# EasyEDA Pro project PID调试器（第二版）.eprj, board PCB1
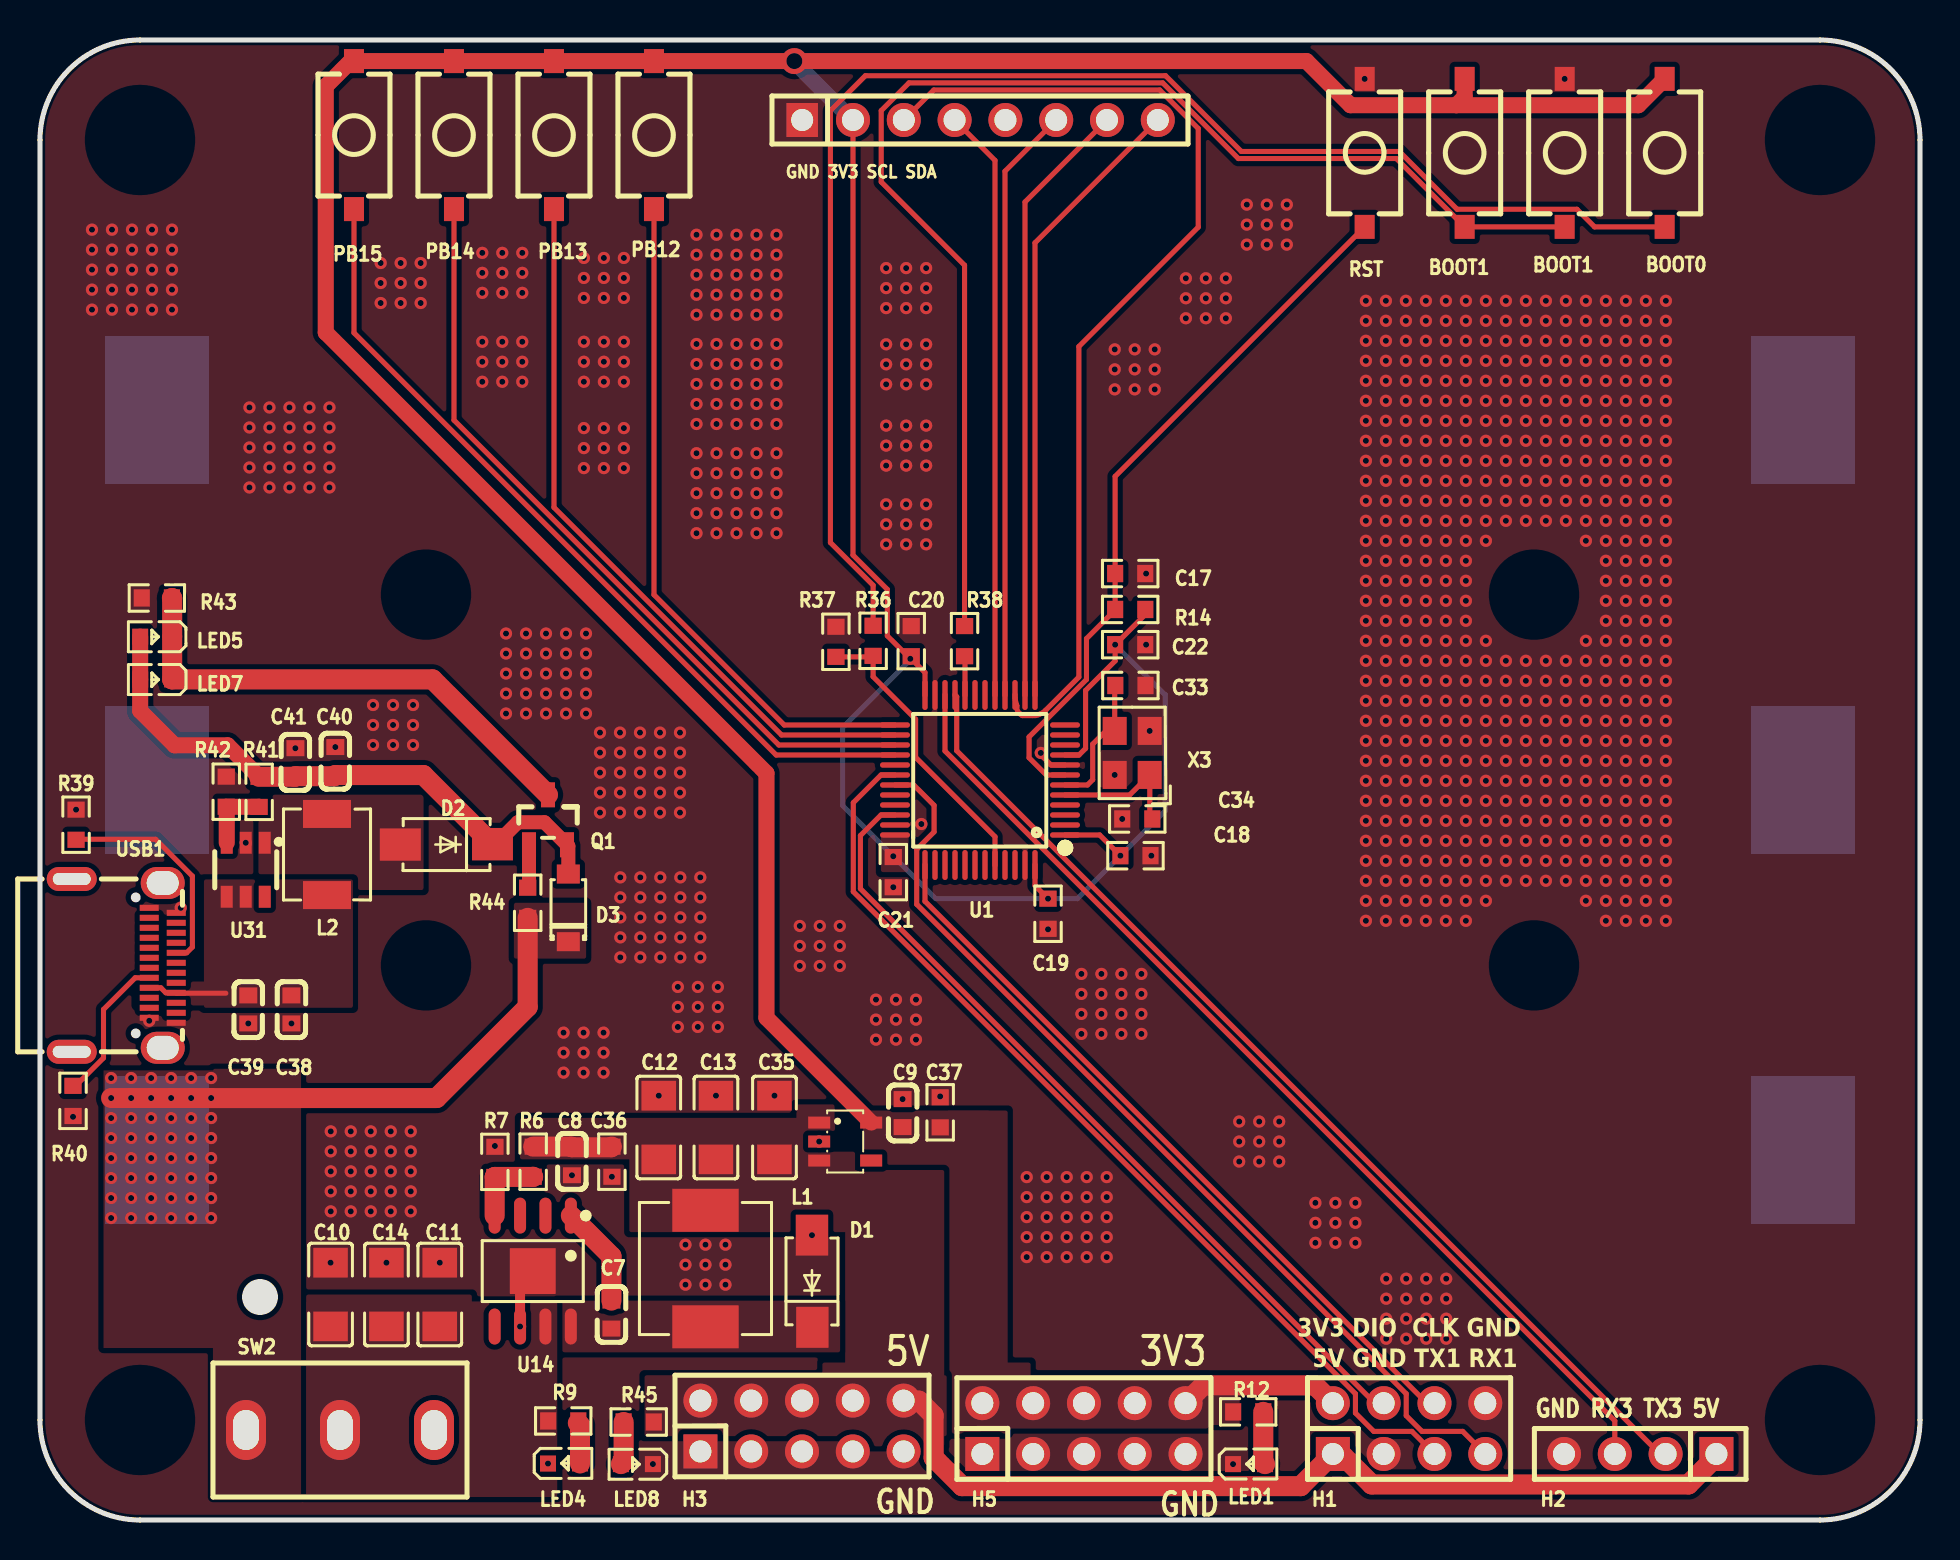
[diagram p1: board, top side]
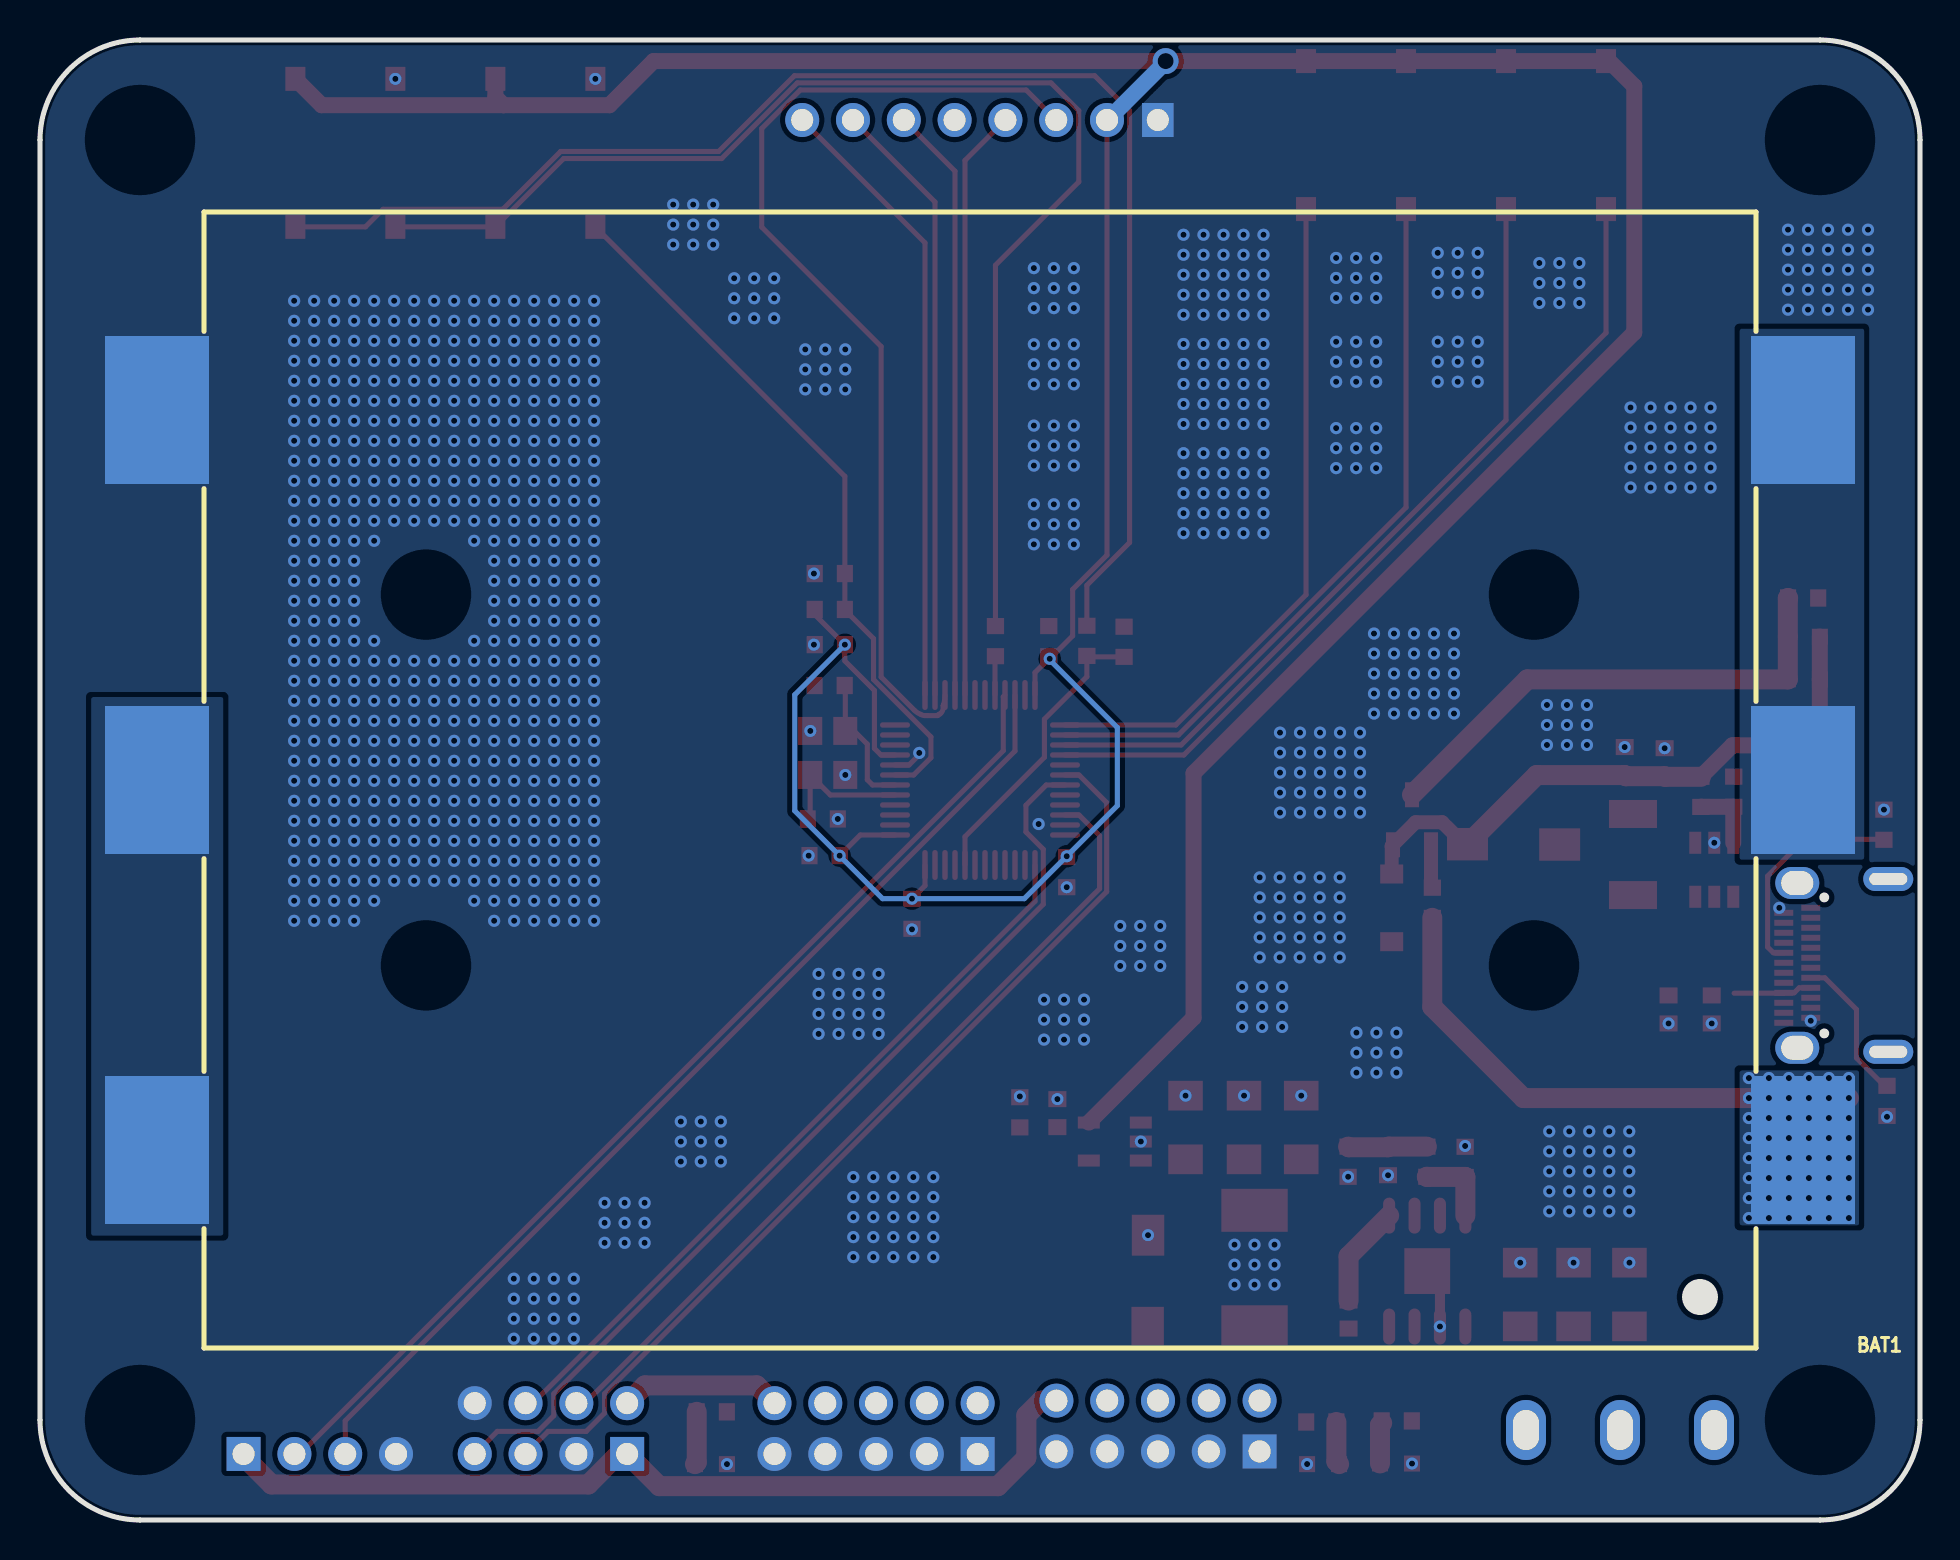
[diagram p2: board, bottom side, seen from below]

Outline 94 x 74 mm; copper layers: Top Layer, Bottom Layer. Coordinates in mm from the lower left corner of the outline.
Outline path: 0,69 0,5 arc(1.46,1.46) 5,0 89,0 arc(92.54,1.46) 94,5 94,69 arc(92.54,72.54) 89,74 5,74 arc(1.46,72.54) 0,69
Stack: Top Layer 0.035mm / Dielectric1 1.51mm FR4 er 4.5 / Bottom Layer 0.035mm

## Design rules (mm)
net OSC_OUT: DP1
net OSC_IN: DP1
template: 自定义配置
spacing copperThickness1oz (default): track to track 0.102, other pairs 0.152 to 0.3
spacing copperThickness2oz: track to track 0.203, other pairs 0.152 to 0.3
track width copperThickness1oz (default): min 0.127, default 0.254, max 2.54
track width copperThickness2oz: min 0.203, default 0.254, max 2.54
differential pair differentialPair (default): width min 0.127, default 0.254, max 2.54; gap min 0.152, default 0.152
via viaSize (default): diameter min 0.5, default 0.61, max 10; hole min 0.3, default 0.305, max 6.3

## Placement (name value [footprint] x y rotation side)
BAT1  BH-18650-B5BA016  [BAT-SMD_BH-18650-B5BA016]  47 37 0 bottom
BOOT0  TS-1101-B-W  [KEY-SMD_2P-L6.0-W3.6-P7.4-LS8.0-L]  81.23 68.36 90 top
BOOT1  -  [KEY-SMD_2P-L6.0-W3.6-P7.4-LS8.0-L]  71.23 68.36 90 top
BOOT1#2  -  [KEY-SMD_2P-L6.0-W3.6-P7.4-LS8.0-L]  76.23 68.36 270 top
C7  100nF  [C0603]  28.57 10.27 270 top
C8  100nF  [C0603]  26.6 17.94 90 top
C9  100nF  [C0603]  43.13 20.34 270 top
C10  100uF  [C1206]  14.53 11.27 270 top
C11  100uF  [C1206]  19.99 11.27 270 top
C12  100uF  [C1206]  30.94 19.62 270 top
C13  100uF  [C1206]  33.8 19.62 270 top
C14  100uF  [C1206]  17.32 11.27 270 top
C17  100nF  [R0603]  54.51 47.32 180 top
C18  100nF  [R0603]  54.77 33.22 180 top
C19  100nF  [R0603]  50.4 30.31 90 top
C20  100nF  [R0603]  43.56 43.94 270 top
C21  100nF  [R0603]  42.66 32.39 90 top
C22  100nF  [R0603]  54.51 43.77 180 top
C33  12pF  [R0603]  54.52 41.72 180 top
C34  12pF  [R0603]  54.86 35.05 180 top
C35  100uF  [C1206]  36.72 19.62 270 top
C36  100nF  [R0603]  28.59 17.92 90 top
C37  100nF  [R0603]  45.01 20.38 270 top
C38  22uF  [C0603]  12.57 25.53 90 top
C39  22uF  [C0603]  10.41 25.53 90 top
C40  22uF  [C0603]  14.77 37.95 90 top
C41  22uF  [C0603]  12.77 37.89 90 top
D1  SS54  [SMA_L4.3-W2.6-LS5.0-FD]  38.61 11.94 270 top
D2  SS34  [SMA_L4.3-W2.6-LS5.0-FD]  20.32 33.78 0 top
D3  1N4148W-E3-08  [SOD-123_L2.8-W1.8-LS3.7-RD]  26.42 30.61 90 top
GND 3V3 SCL SDA  PM254-1-08-Z-8.5  [HDR-TH_8P-P2.54-V-F]  47 70 0 top
H1  HX PZ2.54-4x2P ZZ  [HDR-TH_8P-P2.54-V-M-R2-C4-S2.54]  68.45 4.57 0 top
H2  2.54-1*4P母  [HDR-TH_4P-P2.54-V-F]  80.01 3.3 180 top
H3  PZ254V-12-10P  [HDR-TH_10P-P2.54-V-M-R2-C5-S2.54]  38.1 4.7 0 top
H5  PZ254V-12-10P  [HDR-TH_10P-P2.54-V-M-R2-C5-S2.54]  52.2 4.57 0 top
L1  22uH  [IND-SMD_L7.1-W6.6]  33.27 12.57 90 top
L2  3.3uH  [IND-SMD_L4.4-W4.2-A]  14.35 33.27 270 top
LED1  LTST-C190KSKT  [LED0603-RD]  60.45 2.79 0 top
LED4  -  [LED_0603]  26.25 2.83 0 top
LED5  -  [LED_0603]  5.76 44.16 180 top
LED7  -  [LED_0603]  5.76 42.02 180 top
LED8  LTST-C190KSKT  [LED0603-RD]  29.84 2.79 180 top
PB12  TS-1101-B-W  [KEY-SMD_2P-L6.0-W3.6-P7.4-LS8.0-L]  30.7 69.25 90 top
PB13  TS-1101-B-W  [KEY-SMD_2P-L6.0-W3.6-P7.4-LS8.0-L]  25.7 69.25 90 top
PB14  TS-1101-B-W  [KEY-SMD_2P-L6.0-W3.6-P7.4-LS8.0-L]  20.7 69.25 90 top
PB15  TS-1101-B-W  [KEY-SMD_2P-L6.0-W3.6-P7.4-LS8.0-L]  15.7 69.25 90 top
Q1  -  [S8550P_SOT]  25.4 35.05 270 top
R6  10K  [R0603]  24.66 17.92 90 top
R7  10K  [R0603]  22.74 17.91 270 top
R9  1K  [R0603]  26.16 4.95 180 top
R12  1kΩ  [R0603]  60.41 5.41 180 top
R14  10kΩ  [R0603]  54.51 45.53 0 top
R36  360  [R0603]  41.66 43.96 90 top
R37  1.5K  [R0603]  39.8 43.91 270 top
R38  1.5K  [R0603]  46.23 43.94 270 top
R39  5.1K  [R0603]  1.8 34.76 270 top
R40  5.1K  [R0603]  1.65 20.95 270 top
R41  190K  [R0603]  10.96 36.41 270 top
R42  10K  [R0603]  9.31 36.42 90 top
R43  500R  [R0603]  5.84 46.1 0 top
R44  1K  [R0603]  24.38 30.86 90 top
R45  1kΩ  [R0603]  29.93 4.9 0 top
RST  TS-1101-B-W  [KEY-SMD_2P-L6.0-W3.6-P7.4-LS8.0-L]  66.23 68.36 270 top
SW2  SS-12D10L5  [SW-TH_SS-12D10L5]  15 4.5 180 top
U1  STM32F103C8T6  [LQFP-48_L7.0-W7.0-P0.50-LS9.0-BL]  47 37 90 top
U14  TPS5450DDAR  [SOP-8_L4.9-W3.9-P1.27-LS6.0-BL-EP]  24.64 12.45 180 top
U15  TLV75533PDBVR  [SOT-23-5_L3.0-W1.7-P0.95-LS2.8-BR]  40.26 18.92 180 top
U31  HFP6291LR-G1  [SOT-23-6_L2.9-W1.6-P0.95-LS2.8-BR]  10.29 32.51 90 top
USB1  TYPEC-324G-BCP24  [USB-C-SMD_TYPEC-324G-BCP24]  4.2 27.73 270 top
X3  8MHz  [CRYSTAL-SMD_4P-L3.2-W2.5-BL-1]  54.61 38.35 90 top

## Footprints (pads in the part's own frame, mm; a bottom-side part is the same pattern mirrored in y, then rotated)
BAT-SMD_BH-18650-B5BA016
  rect 5.2x7.4 smd: 1(-41.15,18.5) 2(41.15,18.5) 3(-41.15,0) 4(41.15,0) 5(-41.15,-18.5) 6(41.15,-18.5)
C0603
  rect 0.8x0.9 smd: 1(-0.7,0) 2(0.7,0)
C1206
  rect 1.485x1.728 smd: 1(-1.593,0) 2(1.593,0)
CRYSTAL-SMD_4P-L3.2-W2.5-BL-1
  rect 1.4x1.2 smd: 1(-1.1,-0.875) 2(1.1,-0.875) 3(1.1,0.875) 4(-1.1,0.875)
HDR-TH_4P-P2.54-V-F
  rect 1.7x1.7 hole 1.1: 1(-3.81,0)
  round 1.7 hole 1.1: 2(-1.27,0) 3(1.27,0) 4(3.81,0)
HDR-TH_8P-P2.54-V-F
  rect 1.575x1.7 hole 1.1: 1(-8.89,0)
  round 1.7 hole 1.1: 2(-6.35,0) 3(-3.81,0) 4(-1.27,0) 5(1.27,0) 6(3.81,0) 7(6.35,0) 8(8.89,0)
HDR-TH_8P-P2.54-V-M-R2-C4-S2.54
  rect 1.7x1.7 hole 1.1: 1(-3.81,-1.27)
  round 1.7 hole 1.1: 2(-3.81,1.27) 3(-1.27,-1.27) 4(-1.27,1.27) 5(1.27,-1.27) 6(1.27,1.27) 7(3.81,-1.27) 8(3.81,1.27)
HDR-TH_10P-P2.54-V-M-R2-C5-S2.54
  rect 1.7x1.7 hole 1.1: 1(-5.08,-1.27)
  round 1.7 hole 1.1: 2(-5.08,1.27) 3(-2.54,-1.27) 4(-2.54,1.27) 5(0,-1.27) 6(0,1.27) 7(2.54,-1.27) 8(2.54,1.27) 9(5.08,-1.27) 10(5.08,1.27)
IND-SMD_L4.4-W4.2-A
  rect 1.4x2.4 smd: 1(2.028,0) 2(-2.028,0)
IND-SMD_L7.1-W6.6
  rect 2.15x3.32 smd: 1(-2.913,0) 2(2.913,0)
KEY-SMD_2P-L6.0-W3.6-P7.4-LS8.0-L
  rect 1.2x1 smd: 1(-3.7,0) 2(3.7,0)
LED0603-RD
  rect 0.8x0.8 smd: 1(-0.799,0) 2(0.799,0)
LED_0603
  rect 0.8x0.8 smd: 1(-0.851,-0.01) 2(0.75,-0.005)
LQFP-48_L7.0-W7.0-P0.50-LS9.0-BL
  oval 0.27x1.5 smd: 1(-2.75,-4.25) 2(-2.25,-4.25) 3(-1.75,-4.25) 4(-1.25,-4.25) 5(-0.75,-4.25) 6(-0.25,-4.25) 7(0.25,-4.25) 8(0.75,-4.25) 9(1.25,-4.25) 10(1.75,-4.25) 11(2.25,-4.25) 12(2.75,-4.25) 25(2.75,4.25) 26(2.25,4.25) 27(1.75,4.25) 28(1.25,4.25) 29(0.75,4.25) 30(0.25,4.25) 31(-0.25,4.25) 32(-0.75,4.25) 33(-1.25,4.25) 34(-1.75,4.25) 35(-2.25,4.25) 36(-2.75,4.25)
  oval 1.5x0.27 smd: 13(4.25,-2.75) 14(4.25,-2.25) 15(4.25,-1.75) 16(4.25,-1.25) 17(4.25,-0.75) 18(4.25,-0.25) 19(4.25,0.25) 20(4.25,0.75) 21(4.25,1.25) 22(4.25,1.75) 23(4.25,2.25) 24(4.25,2.75) 37(-4.25,2.75) 38(-4.25,2.25) 39(-4.25,1.75) 40(-4.25,1.25) 41(-4.25,0.75) 42(-4.25,0.25) 43(-4.25,-0.25) 44(-4.25,-0.75) 45(-4.25,-1.25) 46(-4.25,-1.75) 47(-4.25,-2.25) 48(-4.25,-2.75)
R0603
  rect 0.806x0.864 smd: 1(-0.753,0) 2(0.753,0)
S8550P_SOT
  rect 1.25x0.701 smd: 1(1.292,-0.95) 2(1.292,0.95) 3(-1.208,0)
SMA_L4.3-W2.6-LS5.0-FD
  rect 2.046x1.62 smd: 1(-2.304,-0.009) 2(2.304,0.009)
SOD-123_L2.8-W1.8-LS3.7-RD
  rect 0.95x1.15 smd: 1(-1.692,0) 2(1.692,0)
SOP-8_L4.9-W3.9-P1.27-LS6.0-BL-EP
  oval 0.6x1.8 smd: 1(-1.905,-2.772) 2(-0.635,-2.772) 3(0.635,-2.772) 4(1.905,-2.772) 5(1.905,2.772) 6(0.635,2.772) 7(-0.635,2.772) 8(-1.905,2.772)
  rect 2.29x2.29 smd: 9(0,0)
SOT-23-5_L3.0-W1.7-P0.95-LS2.8-BR
  rect 1.1x0.6 smd: 1(1.3,-0.95) 2(1.3,0) 3(1.3,0.95) 4(-1.3,0.95) 5(-1.3,-0.95)
SOT-23-6_L2.9-W1.6-P0.95-LS2.8-BR
  rect 1.1x0.6 smd: 1(1.35,-0.95) 2(1.35,0) 3(1.35,0.95) 4(-1.35,0.95) 5(-1.35,0) 6(-1.35,-0.95)
SW-TH_SS-12D10L5
  oval 2x3 hole 1.3x2: 1(-4.7,0) 2(0,0) 3(4.7,0)
USB-C-SMD_TYPEC-324G-BCP24
  oval 1.6x2.2 hole 1.2x1.6: 1(-4.12,1.938) 2(4.12,1.938)
  oval 1.2x2.5 hole 0.6x1.9: 3(-4.32,-2.612) 4(4.32,-2.612)
  rect 0.3x0.95 smd: A1(-2.63,2.612) A2(-2.13,2.612) A3(-1.63,2.612) A4(-1.13,2.612) A5(-0.63,2.612) A6(-0.13,2.612) A7(0.37,2.612) A8(0.87,2.612) A9(1.37,2.612) A10(1.87,2.612) A11(2.37,2.612) A12(2.87,2.612) B1(2.62,1.262) B2(2.12,1.262) B3(1.62,1.262) B4(1.12,1.262) B5(0.62,1.262) B6(0.12,1.262) B7(-0.38,1.262) B8(-0.88,1.262) B9(-1.38,1.262) B10(-1.88,1.262) B11(-2.38,1.262) B12(-2.88,1.262)

## Nets
3V3: BOOT0.2 BOOT1.2 C9.2 C18.2 C19.2 C20.2 C21.2 C22.2 C37.2 GND 3V3 SCL SDA.2 H1.2 H5.2 H5.4 H5.6 H5.8 H5.10 PB12.2 PB13.2 PB14.2 PB15.2 R12.2 R14.2 U1.1 U1.9 U1.24 U1.36 U1.48 U15.5
+5V: C8.2 C12.2 C13.2 C35.2 C36.2 H1.1 H2.1 H3.2 H3.4 H3.6 H3.8 H3.10 L1.2 R6.2 R45.2 U15.1 U15.3
+12V: C40.1 C41.1 D2.2 D3.2 LED5.2 LED7.2 Q1.2 R41.1
GND: BAT1.6 BOOT1#2.1 C8.1 C9.1 C10.1 C11.1 C12.1 C13.1 C14.1 C17.1 C18.1 C19.1 C20.1 C21.1 C22.1 C33.1 C34.2 C35.1 C36.1 C37.1 C38.1 C39.1 C40.2 C41.2 D1.1 GND 3V3 SCL SDA.1 H1.3 H1.8 H2.4 H3.1 H3.3 H3.5 H3.7 H3.9 H5.1 H5.3 H5.5 H5.7 H5.9 LED1.1 LED4.1 LED8.1 R7.1 R37.1 R39.1 R40.2 R42.2 R43.1 RST.1 U1.8 U1.23 U1.35 U1.47 U14.6 U14.9 U15.2 U31.2 USB1.A1 USB1.A12 USB1.B1 USB1.B12 X3.2 X3.4
VCC: C38.2 C39.2 L2.1 U31.4 U31.5 USB1.A9 USB1.B4
VIN: BAT1.1 D3.1 R44.1 SW2.3
BOOT0: R36.1 R37.2 U1.44
BOOT1: R38.2 U1.20
NRST: C17.2 R14.1 RST.2 U1.7
OSC32_IN: U1.3
OSC32_OUT: U1.4
OSC_IN: C34.1 U1.5 X3.1
OSC_OUT: C33.2 U1.6 X3.3
PA0: U1.10
PA1: U1.11
PA2: U1.12
PA3_BL: GND 3V3 SCL SDA.8 U1.13
PA6_DC: GND 3V3 SCL SDA.6 U1.16
PA8: U1.29
PA13/SWDIO: H1.4 U1.34
PA14/SWCLK: H1.6 U1.37
PA15: U1.38
PB0_DC: U1.18
PB1_BL: U1.19
PB3: U1.39
PB4: U1.40
PB5: U1.41
PB6: U1.42
PB7: U1.43
PB8: U1.45
PB9: U1.46
PB12_01: PB12.1 U1.25
PB13_02: PB13.1 U1.26
PB14_03: PB14.1 U1.27
PB15_04: PB15.1 U1.28
PC13: U1.2
SPI_CS_NSS: GND 3V3 SCL SDA.7 U1.14
SPI_SCL_SCK: GND 3V3 SCL SDA.3 U1.15
SPI_SDA_MOSI: GND 3V3 SCL SDA.4 U1.17
USART1_RX: H1.7 U1.31
USART1_TX: H1.5 U1.30
USART3_RX: H2.3 U1.22
USART3_TX: H2.2 U1.21
USB_D+_PA12: U1.33
USB_D-_PA11: U1.32
$1N1992: LED1.2 R12.1
$1N3257: BOOT1.1 BOOT1#2.2 R38.1
$1N4251: C10.2 C11.2 C14.2 R9.2 SW2.2 U14.7
$1N4254: C7.2 D1.2 L1.1 U14.8
$1N4256: C7.1 U14.1
$1N4260: R6.1 R7.2 U14.4
$1N4269: LED4.2 R9.1
$1N6190: BAT1.2 BAT1.4
$1N6207: BAT1.3 BAT1.5
$1N14427: R39.2 USB1.A5
$1N14460: R40.1 USB1.B5
$1N14741: D2.1 L2.2 U31.1
$1N14892: R41.2 R42.1 U31.3
$1N19318: LED5.1 LED7.1 Q1.3 R43.2
$1N19371: Q1.1 R44.2
$1N21612: BOOT0.1 R36.2
$1N31426: LED8.2 R45.1

Pads without a net: GND 3V3 SCL SDA 5; SW2 1; U14 2 3 5; U15 4; U31 6; USB1 1 2 3 4 A2 A3 A4 A6 A7 A8 A10 A11 B2 B3 B6 B7 B8 B9 B10 B11

## Via types
v1: diameter 0.61, hole 0.305, Top Layer to Bottom Layer, 1032 vias
v2: diameter 1.3, hole 0.8, Top Layer to Bottom Layer, 1 via

## Routing (per net, layer and track width the routed paths; a pad name or vN(x,y) marks a point on that pad's centre or on a via; arc(x,y) is an arc through that point)
3V3: length 228.4
  Top Layer w0.254: R14.2 55.26,45.27 v1(53.76,43.77) 53.76,42.95 52.28,41.48 52.28,38.58 51.95,38.25 U1.9 ; U1.48 49.75,31.72 v1(50.4,31.07) ; U1.24 44.25,42.37 43.69,42.93 ; v1(54.02,33.22) 52.99,34.25 U1.1 ; GND 3V3 SCL SDA.2 40.65,48.25 42.37,46.53 42.37,44.21 v1(43.51,43.06)
  Top Layer w0.8: 70.82,70.74 65.53,70.74 63.32,72.95 v2(37.72,72.95) PB12.2 PB13.2 PB14.2 PB15.2 15.64,73.01 15.61,73.01 14.29,71.69 14.29,59.37 36.32,37.34 36.32,25.11 U15.5 ; 70.82,70.74 79.92,70.74 BOOT0.2 ; 70.82,70.74 71.23,71.15 BOOT1.2
  Top Layer w1: 57.28,5.84 58.17,6.73 63.75,6.73 H1.2
  Bottom Layer w0.254: v1(53.76,43.77) 56.26,41.26 56.26,35.46 v1(54.02,33.22) 51.87,31.07 v1(50.4,31.07) 44.79,31.07 v1(42.66,33.19) 40.13,35.72 40.13,39.62 43.51,43.01 v1(43.51,43.06)
  Bottom Layer w0.8: GND 3V3 SCL SDA.2 40.62,70 37.72,72.9 v2(37.72,72.95)
+5V: length 49.5
  Top Layer w1: 43.18,5.97 43.94,5.97 44.68,5.23 44.68,3.12 46.1,1.69 63.03,1.69 H1.1 65.06,3.3 66.58,1.78 82.42,1.78 83.82,3.18 ; C36.2 28.56,18.64 C8.2 26.57,18.67 R6.2
+12V: length 30.3
  Top Layer w0.7: D2.2 22.8,33.79 23.89,34.89 25.22,34.89 Q1.2 26.42,33.69 D3.2
  Top Layer w0.8: R41.1 9.38,38.73 6.73,38.73 5.01,40.46 LED7.2 LED5.2
  Top Layer w1: D2.2 19.17,37.25 C40.1 14.71,37.19 C41.1 12.74,37.16 R41.1
GND: length 3.8
  Top Layer w0.254: v1(50.04,38.35) 50.04,38.26 50.55,37.75 U1.8
  Top Layer w0.5: v1(24,9.67) 24,11.81 24.14,11.95
  vias: v1(1.65,20.16) v1(1.8,35.52) v1(2.6,64.52) v1(2.6,63.52) v1(2.6,62.52) v1(2.6,61.52) v1(2.6,60.52) v1(3.6,64.52) v1(3.6,63.52) v1(3.6,62.52) v1(3.6,61.52) v1(3.6,60.52) v1(4.6,64.52) v1(4.6,63.52) v1(4.6,62.52) v1(4.6,61.52) v1(4.6,60.52) v1(5.46,24.96) v1(5.6,64.52) v1(5.6,63.52) v1(5.6,62.52) v1(5.6,61.52) v1(5.6,60.52) v1(6.6,64.52) v1(6.6,63.52) v1(6.6,62.52) v1(6.6,61.52) v1(6.6,60.52) v1(7.04,30.61) v1(10.29,33.86) v1(10.41,24.83) v1(10.47,55.63) v1(10.47,54.63) v1(10.47,53.63) v1(10.47,52.63) v1(10.47,51.63) v1(11.47,55.63) v1(11.47,54.63) v1(11.47,53.63) v1(11.47,52.63) v1(11.47,51.63) v1(12.47,55.63) v1(12.47,54.63) v1(12.47,53.63) v1(12.47,52.63) v1(12.47,51.63) v1(12.57,24.83) v1(12.77,38.59) v1(13.47,55.63) v1(13.47,54.63) v1(13.47,53.63) v1(13.47,52.63) v1(13.47,51.63) v1(14.47,55.63) v1(14.47,54.63) v1(14.47,53.63) v1(14.47,52.63) v1(14.47,51.63) v1(14.54,19.43) v1(14.54,18.43) v1(14.54,17.43) v1(14.54,16.43) v1(14.54,15.43) v1(14.53,12.87) v1(14.77,38.65) v1(15.54,19.43) v1(15.54,18.43) v1(15.54,17.43) v1(15.54,16.43) v1(15.54,15.43) v1(16.54,19.43) v1(16.54,18.43) v1(16.54,17.43) v1(16.54,16.43) v1(16.54,15.43) v1(16.65,40.75) v1(16.65,39.75) v1(16.65,38.75) v1(17.03,62.85) v1(17.03,61.85) v1(17.03,60.85) v1(17.32,12.87) v1(17.54,19.43) v1(17.54,18.43) v1(17.54,17.43) v1(17.54,16.43) v1(17.54,15.43) v1(17.65,40.75) v1(17.65,39.75) v1(17.65,38.75) v1(18.03,62.85) v1(18.03,61.85) v1(18.03,60.85) v1(18.54,19.43) v1(18.54,18.43) v1(18.54,17.43) v1(18.54,16.43) v1(18.54,15.43) v1(18.65,40.75) v1(18.65,39.75) v1(18.65,38.75) v1(19.03,62.85) v1(19.03,61.85) v1(19.03,60.85) v1(19.99,12.87) v1(22.11,63.36) v1(22.11,62.36) v1(22.11,61.36) v1(22.11,58.91) v1(22.11,57.91) v1(22.11,56.91) v1(22.74,18.7) v1(23.11,63.36) v1(23.11,62.36) v1(23.11,61.36) v1(23.11,58.91) v1(23.11,57.91) v1(23.11,56.91) v1(23.3,44.32) v1(23.3,43.32) v1(23.3,42.32) v1(23.3,41.32) v1(23.3,40.32) v1(24.11,63.36) v1(24.11,62.36) v1(24.11,61.36) v1(24.11,58.91) v1(24.11,57.91) v1(24.11,56.91) v1(24.3,44.32) v1(24.3,43.32) v1(24.3,42.32) v1(24.3,41.32) v1(24.3,40.32) v1(25.3,44.32) v1(25.3,43.32) v1(25.3,42.32) v1(25.3,41.32) v1(25.3,40.32) v1(25.4,2.82) v1(26.18,24.37) v1(26.18,23.37) v1(26.18,22.37) v1(26.3,44.32) v1(26.3,43.32) v1(26.3,42.32) v1(26.3,41.32) v1(26.3,40.32) v1(26.6,17.24) v1(27.19,63.1) v1(27.19,62.1) v1(27.19,61.1) v1(27.19,58.91) v1(27.19,57.91) v1(27.19,56.91) v1(27.19,54.59) v1(27.19,53.59) v1(27.19,52.59) v1(27.18,24.37) v1(27.18,23.37) v1(27.18,22.37) v1(27.3,44.32) v1(27.3,43.32) v1(27.3,42.32) v1(27.3,41.32) v1(27.3,40.32) v1(28,39.37) v1(28,38.37) v1(28,37.37) v1(28,36.37) v1(28,35.37) v1(28.19,63.1) v1(28.19,62.1) v1(28.19,61.1) v1(28.19,58.91) v1(28.19,57.91) v1(28.19,56.91) v1(28.19,54.59) v1(28.19,53.59) v1(28.19,52.59) v1(28.18,24.37) v1(28.18,23.37) v1(28.18,22.37) v1(28.59,17.16) v1(29,39.37) v1(29,38.37) v1(29,37.37) v1(29,36.37) v1(29,35.37) v1(29.02,32.13) v1(29.02,31.13) v1(29.02,30.13) v1(29.02,29.13) v1(29.02,28.13) v1(29.19,63.1) v1(29.19,62.1) v1(29.19,61.1) v1(29.19,58.91) v1(29.19,57.91) v1(29.19,56.91) v1(29.19,54.59) v1(29.19,53.59) v1(29.19,52.59) v1(30,39.37) v1(30,38.37) v1(30,37.37) v1(30,36.37) v1(30,35.37) v1(30.02,32.13) v1(30.02,31.13) v1(30.02,30.13) v1(30.02,29.13) v1(30.02,28.13) v1(30.65,2.8) v1(30.94,21.22) v1(31,39.37) v1(31,38.37) v1(31,37.37) v1(31,36.37) v1(31,35.37) v1(31.02,32.13) v1(31.02,31.13) v1(31.02,30.13) v1(31.02,29.13) v1(31.02,28.13) v1(31.89,26.65) v1(31.89,25.65) v1(31.89,24.65) v1(32,39.37) v1(32,38.37) v1(32,37.37) v1(32,36.37) v1(32,35.37) v1(32.02,32.13) v1(32.02,31.13) v1(32.02,30.13) v1(32.02,29.13) v1(32.02,28.13) v1(32.27,13.77) v1(32.27,12.77) v1(32.27,11.77) v1(32.83,64.26) v1(32.83,63.26) v1(32.83,62.26) v1(32.83,61.26) v1(32.83,60.26) v1(32.83,58.8) v1(32.83,57.8) v1(32.83,56.8) v1(32.83,55.8) v1(32.83,54.8) v1(32.83,53.34) v1(32.83,52.34) v1(32.83,51.34) v1(32.83,50.34) v1(32.83,49.34) v1(32.89,26.65) v1(32.89,25.65) v1(32.89,24.65) v1(33.02,32.13) v1(33.02,31.13) v1(33.02,30.13) v1(33.02,29.13) v1(33.02,28.13) v1(33.27,13.77) v1(33.27,12.77) v1(33.27,11.77) v1(33.83,64.26) v1(33.83,63.26) v1(33.83,62.26) v1(33.83,61.26) v1(33.83,60.26) v1(33.83,58.8) v1(33.83,57.8) v1(33.83,56.8) v1(33.83,55.8) v1(33.83,54.8) v1(33.83,53.34) v1(33.83,52.34) v1(33.83,51.34) v1(33.83,50.34) v1(33.83,49.34) v1(33.8,21.22) v1(33.89,26.65) v1(33.89,25.65) v1(33.89,24.65) v1(34.27,13.77) v1(34.27,12.77) v1(34.27,11.77) v1(34.83,64.26) v1(34.83,63.26) v1(34.83,62.26) v1(34.83,61.26) v1(34.83,60.26) v1(34.83,58.8) v1(34.83,57.8) v1(34.83,56.8) v1(34.83,55.8) v1(34.83,54.8) v1(34.83,53.34) v1(34.83,52.34) v1(34.83,51.34) v1(34.83,50.34) v1(34.83,49.34) v1(35.83,64.26) v1(35.83,63.26) v1(35.83,62.26) v1(35.83,61.26) v1(35.83,60.26) v1(35.83,58.8) v1(35.83,57.8) v1(35.83,56.8) v1(35.83,55.8) v1(35.83,54.8) v1(35.83,53.34) v1(35.83,52.34) v1(35.83,51.34) v1(35.83,50.34) v1(35.83,49.34) v1(36.72,21.22) v1(36.83,64.26) v1(36.83,63.26) v1(36.83,62.26) v1(36.83,61.26) v1(36.83,60.26) v1(36.83,58.8) v1(36.83,57.8) v1(36.83,56.8) v1(36.83,55.8) v1(36.83,54.8) v1(36.83,53.34) v1(36.83,52.34) v1(36.83,51.34) v1(36.83,50.34) v1(36.83,49.34) v1(37.99,29.7) v1(37.99,28.7) v1(37.99,27.7) v1(38.6,14.24) v1(38.99,29.7) v1(38.99,28.7) v1(38.99,27.7) v1(38.96,18.92) v1(39.99,29.7) v1(39.99,28.7) v1(39.99,27.7) v1(41.8,26.02) v1(41.8,25.02) v1(41.8,24.02) v1(42.31,62.59) v1(42.31,61.59) v1(42.31,60.59) v1(42.31,58.78) v1(42.31,57.78) v1(42.31,56.78) v1(42.31,54.72) v1(42.31,53.72) v1(42.31,52.72) v1(42.31,50.78) v1(42.31,49.78) v1(42.31,48.78) v1(42.66,31.64) v1(42.8,26.02) v1(42.8,25.02) v1(42.8,24.02) v1(43.13,21.04) v1(43.31,62.59) v1(43.31,61.59) v1(43.31,60.59) v1(43.31,58.78) v1(43.31,57.78) v1(43.31,56.78) v1(43.31,54.72) v1(43.31,53.72) v1(43.31,52.72) v1(43.31,50.78) v1(43.31,49.78) v1(43.31,48.78) v1(43.8,26.02) v1(43.8,25.02) v1(43.8,24.02) v1(44.07,34.8) v1(44.31,62.59) v1(44.31,61.59) v1(44.31,60.59) v1(44.31,58.78) v1(44.31,57.78) v1(44.31,56.78) v1(44.31,54.72) v1(44.31,53.72) v1(44.31,52.72) v1(44.31,50.78) v1(44.31,49.78) v1(44.31,48.78) v1(45.01,21.18) v1(49.34,17.14) v1(49.34,16.14) v1(49.34,15.14) v1(49.34,14.14) v1(49.34,13.14) v1(50.34,17.14) v1(50.34,16.14) v1(50.34,15.14) v1(50.34,14.14) v1(50.34,13.14) v1(50.4,29.53) v1(51.34,17.14) v1(51.34,16.14) v1(51.34,15.14) v1(51.34,14.14) v1(51.34,13.14) v1(52.07,27.31) v1(52.07,26.31) v1(52.07,25.31) v1(52.07,24.31) v1(52.34,17.14) v1(52.34,16.14) v1(52.34,15.14) v1(52.34,14.14) v1(52.34,13.14) v1(53.07,27.31) v1(53.07,26.31) v1(53.07,25.31) v1(53.07,24.31) v1(53.34,17.14) v1(53.34,16.14) v1(53.34,15.14) v1(53.34,14.14) v1(53.34,13.14) v1(53.74,58.53) v1(53.74,57.53) v1(53.74,56.53) v1(53.74,37.25) v1(54.11,35.05) v1(54.07,27.31) v1(54.07,26.31) v1(54.07,25.31) v1(54.07,24.31) v1(54.74,58.53) v1(54.74,57.53) v1(54.74,56.53) v1(55.07,27.31) v1(55.07,26.31) v1(55.07,25.31) v1(55.07,24.31) v1(55.31,47.32) v1(55.31,43.77) v1(55.49,39.45) v1(55.57,33.22) v1(55.74,58.53) v1(55.74,57.53) v1(55.74,56.53) v1(57.29,62.09) v1(57.29,61.09) v1(57.29,60.09) v1(58.29,62.09) v1(58.29,61.09) v1(58.29,60.09) v1(59.29,62.09) v1(59.29,61.09) v1(59.29,60.09) v1(59.65,2.79) v1(59.96,19.92) v1(59.96,18.92) v1(59.96,17.92) v1(60.34,65.77) v1(60.34,64.77) v1(60.34,63.77) v1(60.96,19.92) v1(60.96,18.92) v1(60.96,17.92) v1(61.34,65.77) v1(61.34,64.77) v1(61.34,63.77) v1(61.96,19.92) v1(61.96,18.92) v1(61.96,17.92) v1(62.34,65.77) v1(62.34,64.77) v1(62.34,63.77) v1(63.77,15.86) v1(63.77,14.86) v1(63.77,13.86) v1(64.77,15.86) v1(64.77,14.86) v1(64.77,13.86) v1(65.77,15.86) v1(65.77,14.86) v1(65.77,13.86) v1(66.23,72.06) v1(66.29,60.96) v1(66.29,59.96) v1(66.29,58.96) v1(66.29,57.96) v1(66.29,56.96) v1(66.29,55.96) v1(66.29,54.96) v1(66.29,53.96) v1(66.29,52.96) v1(66.29,51.96) v1(66.29,50.96) v1(66.29,49.96) v1(66.29,48.96) v1(66.29,47.96) v1(66.29,46.96) v1(66.29,45.96) v1(66.29,44.96) v1(66.29,43.96) v1(66.29,42.96) v1(66.29,41.96) v1(66.29,40.96) v1(66.29,39.96) v1(66.29,38.96) v1(66.29,37.96) v1(66.29,36.96) v1(66.29,35.96) v1(66.29,34.96) v1(66.29,33.96) v1(66.29,32.96) v1(66.29,31.96) v1(66.29,30.96) v1(66.29,29.96) v1(67.29,60.96) v1(67.29,59.96) v1(67.29,58.96) v1(67.29,57.96) v1(67.29,56.96) v1(67.29,55.96) v1(67.29,54.96) v1(67.29,53.96) v1(67.29,52.96) v1(67.29,51.96) v1(67.29,50.96) v1(67.29,49.96) v1(67.29,48.96) v1(67.29,47.96) v1(67.29,46.96) v1(67.29,45.96) v1(67.29,44.96) v1(67.29,43.96) v1(67.29,42.96) v1(67.29,41.96) v1(67.29,40.96) v1(67.29,39.96) v1(67.29,38.96) v1(67.29,37.96) v1(67.29,36.96) v1(67.29,35.96) v1(67.29,34.96) v1(67.29,33.96) v1(67.29,32.96) v1(67.29,31.96) v1(67.29,30.96) v1(67.29,29.96) v1(67.31,12.06) v1(67.31,11.06) v1(67.31,10.06) v1(67.31,9.06) v1(68.29,60.96) v1(68.29,59.96) v1(68.29,58.96) v1(68.29,57.96) v1(68.29,56.96) v1(68.29,55.96) v1(68.29,54.96) v1(68.29,53.96) v1(68.29,52.96) v1(68.29,51.96) v1(68.29,50.96) v1(68.29,49.96) v1(68.29,48.96) v1(68.29,47.96) v1(68.29,46.96) v1(68.29,45.96) v1(68.29,44.96) v1(68.29,43.96) v1(68.29,42.96) v1(68.29,41.96) v1(68.29,40.96) v1(68.29,39.96) v1(68.29,38.96) v1(68.29,37.96) v1(68.29,36.96) v1(68.29,35.96) v1(68.29,34.96) v1(68.29,33.96) v1(68.29,32.96) v1(68.29,31.96) v1(68.29,30.96) v1(68.29,29.96) v1(68.31,12.06) v1(68.31,11.06) v1(68.31,10.06) v1(68.31,9.06) v1(69.29,60.96) v1(69.29,59.96) v1(69.29,58.96) v1(69.29,57.96) v1(69.29,56.96) v1(69.29,55.96) v1(69.29,54.96) v1(69.29,53.96) v1(69.29,52.96) v1(69.29,51.96) v1(69.29,50.96) v1(69.29,49.96) v1(69.29,48.96) v1(69.29,47.96) v1(69.29,46.96) v1(69.29,45.96) v1(69.29,44.96) v1(69.29,43.96) v1(69.29,42.96) v1(69.29,41.96) v1(69.29,40.96) v1(69.29,39.96) v1(69.29,38.96) v1(69.29,37.96) v1(69.29,36.96) v1(69.29,35.96) v1(69.29,34.96) v1(69.29,33.96) v1(69.29,32.96) v1(69.29,31.96) v1(69.29,30.96) v1(69.29,29.96) v1(69.31,12.06) v1(69.31,11.06) v1(69.31,10.06) v1(69.31,9.06) v1(70.29,60.96) v1(70.29,59.96) v1(70.29,58.96) v1(70.29,57.96) v1(70.29,56.96) v1(70.29,55.96) v1(70.29,54.96) v1(70.29,53.96) v1(70.29,52.96) v1(70.29,51.96) v1(70.29,50.96) v1(70.29,49.96) v1(70.29,48.96) v1(70.29,47.96) v1(70.29,46.96) v1(70.29,45.96) v1(70.29,44.96) v1(70.29,43.96) v1(70.29,42.96) v1(70.29,41.96) v1(70.29,40.96) v1(70.29,39.96) v1(70.29,38.96) v1(70.29,37.96) v1(70.29,36.96) v1(70.29,35.96) v1(70.29,34.96) v1(70.29,33.96) v1(70.29,32.96) v1(70.29,31.96) v1(70.29,30.96) v1(70.29,29.96) v1(70.31,12.06) v1(70.31,11.06) v1(70.31,10.06) v1(70.31,9.06) v1(71.29,60.96) v1(71.29,59.96) v1(71.29,58.96) v1(71.29,57.96) v1(71.29,56.96) v1(71.29,55.96) v1(71.29,54.96) v1(71.29,53.96) v1(71.29,52.96) v1(71.29,51.96) v1(71.29,50.96) v1(71.29,49.96) v1(71.29,48.96) v1(71.29,47.96) v1(71.29,46.96) v1(71.29,45.96) v1(71.29,44.96) v1(71.29,43.96) v1(71.29,42.96) v1(71.29,41.96) v1(71.29,40.96) v1(71.29,39.96) v1(71.29,38.96) v1(71.29,37.96) v1(71.29,36.96) v1(71.29,35.96) v1(71.29,34.96) v1(71.29,33.96) v1(71.29,32.96) v1(71.29,31.96) v1(71.29,30.96) v1(71.29,29.96) v1(72.29,60.96) v1(72.29,59.96) v1(72.29,58.96) v1(72.29,57.96) v1(72.29,56.96) v1(72.29,55.96) v1(72.29,54.96) v1(72.29,53.96) v1(72.29,52.96) v1(72.29,51.96) v1(72.29,50.96) v1(72.29,49.96) v1(72.29,48.96) v1(72.29,43.96) v1(72.29,42.96) v1(72.29,41.96) v1(72.29,40.96) v1(72.29,39.96) v1(72.29,38.96) v1(72.29,37.96) v1(72.29,36.96) v1(72.29,35.96) v1(72.29,34.96) v1(72.29,33.96) v1(72.29,32.96) v1(72.29,31.96) v1(72.29,30.96) v1(73.29,60.96) v1(73.29,59.96) v1(73.29,58.96) v1(73.29,57.96) v1(73.29,56.96) v1(73.29,55.96) v1(73.29,54.96) v1(73.29,53.96) v1(73.29,52.96) v1(73.29,51.96) v1(73.29,50.96) v1(73.29,49.96) v1(73.29,42.96) v1(73.29,41.96) v1(73.29,40.96) v1(73.29,39.96) v1(73.29,38.96) v1(73.29,37.96) v1(73.29,36.96) v1(73.29,35.96) v1(73.29,34.96) v1(73.29,33.96) v1(73.29,32.96) v1(73.29,31.96) v1(74.29,60.96) v1(74.29,59.96) v1(74.29,58.96) v1(74.29,57.96) v1(74.29,56.96) v1(74.29,55.96) v1(74.29,54.96) v1(74.29,53.96) v1(74.29,52.96) v1(74.29,51.96) v1(74.29,50.96) v1(74.29,49.96) v1(74.29,42.96) v1(74.29,41.96) v1(74.29,40.96) v1(74.29,39.96) v1(74.29,38.96) v1(74.29,37.96) v1(74.29,36.96) v1(74.29,35.96) v1(74.29,34.96) v1(74.29,33.96) v1(74.29,32.96) v1(74.29,31.96) v1(75.29,60.96) v1(75.29,59.96) v1(75.29,58.96) v1(75.29,57.96) v1(75.29,56.96) v1(75.29,55.96) v1(75.29,54.96) v1(75.29,53.96) v1(75.29,52.96) v1(75.29,51.96) v1(75.29,50.96) v1(75.29,49.96) v1(75.29,42.96) v1(75.29,41.96) v1(75.29,40.96) v1(75.29,39.96) v1(75.29,38.96) v1(75.29,37.96) v1(75.29,36.96) v1(75.29,35.96) v1(75.29,34.96) v1(75.29,33.96) v1(75.29,32.96) v1(75.29,31.96) v1(76.23,72.06) v1(76.29,60.96) v1(76.29,59.96) v1(76.29,58.96) v1(76.29,57.96) v1(76.29,56.96) v1(76.29,55.96) v1(76.29,54.96) v1(76.29,53.96) v1(76.29,52.96) v1(76.29,51.96) v1(76.29,50.96) v1(76.29,49.96) v1(76.29,42.96) v1(76.29,41.96) v1(76.29,40.96) v1(76.29,39.96) v1(76.29,38.96) v1(76.29,37.96) v1(76.29,36.96) v1(76.29,35.96) v1(76.29,34.96) v1(76.29,33.96) v1(76.29,32.96) v1(76.29,31.96) v1(77.29,60.96) v1(77.29,59.96) v1(77.29,58.96) v1(77.29,57.96) v1(77.29,56.96) v1(77.29,55.96) v1(77.29,54.96) v1(77.29,53.96) v1(77.29,52.96) v1(77.29,51.96) v1(77.29,50.96) v1(77.29,49.96) v1(77.29,48.96) v1(77.29,43.96) v1(77.29,42.96) v1(77.29,41.96) v1(77.29,40.96) v1(77.29,39.96) v1(77.29,38.96) v1(77.29,37.96) v1(77.29,36.96) v1(77.29,35.96) v1(77.29,34.96) v1(77.29,33.96) v1(77.29,32.96) v1(77.29,31.96) v1(77.29,30.96) v1(78.29,60.96) v1(78.29,59.96) v1(78.29,58.96) v1(78.29,57.96) v1(78.29,56.96) v1(78.29,55.96) v1(78.29,54.96) v1(78.29,53.96) v1(78.29,52.96) v1(78.29,51.96) v1(78.29,50.96) v1(78.29,49.96) v1(78.29,48.96) v1(78.29,47.96) v1(78.29,46.96) v1(78.29,45.96) v1(78.29,44.96) v1(78.29,43.96) v1(78.29,42.96) v1(78.29,41.96) v1(78.29,40.96) v1(78.29,39.96) v1(78.29,38.96) v1(78.29,37.96) v1(78.29,36.96) v1(78.29,35.96) v1(78.29,34.96) v1(78.29,33.96) v1(78.29,32.96) v1(78.29,31.96) v1(78.29,30.96) v1(78.29,29.96) v1(79.29,60.96) v1(79.29,59.96) v1(79.29,58.96) v1(79.29,57.96) v1(79.29,56.96) v1(79.29,55.96) v1(79.29,54.96) v1(79.29,53.96) v1(79.29,52.96) v1(79.29,51.96) v1(79.29,50.96) v1(79.29,49.96) v1(79.29,48.96) v1(79.29,47.96) v1(79.29,46.96) v1(79.29,45.96) v1(79.29,44.96) v1(79.29,43.96) v1(79.29,42.96) v1(79.29,41.96) v1(79.29,40.96) v1(79.29,39.96) v1(79.29,38.96) v1(79.29,37.96) v1(79.29,36.96) v1(79.29,35.96) v1(79.29,34.96) v1(79.29,33.96) v1(79.29,32.96) v1(79.29,31.96) v1(79.29,30.96) v1(79.29,29.96) v1(80.29,60.96) v1(80.29,59.96) v1(80.29,58.96) v1(80.29,57.96) v1(80.29,56.96) v1(80.29,55.96) v1(80.29,54.96) v1(80.29,53.96) v1(80.29,52.96) v1(80.29,51.96) v1(80.29,50.96) v1(80.29,49.96) v1(80.29,48.96) v1(80.29,47.96) v1(80.29,46.96) v1(80.29,45.96) v1(80.29,44.96) v1(80.29,43.96) v1(80.29,42.96) v1(80.29,41.96) v1(80.29,40.96) v1(80.29,39.96) v1(80.29,38.96) v1(80.29,37.96) v1(80.29,36.96) v1(80.29,35.96) v1(80.29,34.96) v1(80.29,33.96) v1(80.29,32.96) v1(80.29,31.96) v1(80.29,30.96) v1(80.29,29.96) v1(81.29,60.96) v1(81.29,59.96) v1(81.29,58.96) v1(81.29,57.96) v1(81.29,56.96) v1(81.29,55.96) v1(81.29,54.96) v1(81.29,53.96) v1(81.29,52.96) v1(81.29,51.96) v1(81.29,50.96) v1(81.29,49.96) v1(81.29,48.96) v1(81.29,47.96) v1(81.29,46.96) v1(81.29,45.96) v1(81.29,44.96) v1(81.29,43.96) v1(81.29,42.96) v1(81.29,41.96) v1(81.29,40.96) v1(81.29,39.96) v1(81.29,38.96) v1(81.29,37.96) v1(81.29,36.96) v1(81.29,35.96) v1(81.29,34.96) v1(81.29,33.96) v1(81.29,32.96) v1(81.29,31.96) v1(81.29,30.96) v1(81.29,29.96)
VCC: length 3.9
  Top Layer w0.254: 9.29,26.34 6.83,26.34 USB1.A9 6.29,26.36 6.04,26.61 USB1.B4
VIN: length 27.2
  Top Layer w1: R44.1 24.38,25.65 19.83,21.1 v1(8.56,21.1) v1(7.56,21.1) v1(6.56,21.1) v1(5.56,21.1) v1(4.56,21.1) v1(3.56,21.1)
  vias: v1(3.56,22.1) v1(3.56,20.1) v1(3.56,19.1) v1(3.56,18.1) v1(3.56,17.1) v1(3.56,16.1) v1(3.56,15.1) v1(4.56,22.1) v1(4.56,20.1) v1(4.56,19.1) v1(4.56,18.1) v1(4.56,17.1) v1(4.56,16.1) v1(4.56,15.1) v1(5.56,22.1) v1(5.56,20.1) v1(5.56,19.1) v1(5.56,18.1) v1(5.56,17.1) v1(5.56,16.1) v1(5.56,15.1) v1(6.56,22.1) v1(6.56,20.1) v1(6.56,19.1) v1(6.56,18.1) v1(6.56,17.1) v1(6.56,16.1) v1(6.56,15.1) v1(7.56,22.1) v1(7.56,20.1) v1(7.56,19.1) v1(7.56,18.1) v1(7.56,17.1) v1(7.56,16.1) v1(7.56,15.1) v1(8.56,22.1) v1(8.56,20.1) v1(8.56,19.1) v1(8.56,18.1) v1(8.56,17.1) v1(8.56,16.1) v1(8.56,15.1)
BOOT0: length 14.9
  Top Layer w0.254: U1.44 47.75,34.17 43.78,38.14 43.78,40.04 41.66,42.16 R36.1 41.61,43.16 R37.2
BOOT1: length 1.9
  Top Layer w0.254: R38.2 46.25,43.17 U1.20
NRST: length 35.6
  Top Layer w0.254: U1.7 50.32,37.25 49.45,38.11 49.45,39.15 52.32,42.02 52.32,44.07 53.76,45.5 R14.1 C17.2 53.76,52.18 RST.2
OSC_IN: length 6.9
  Top Layer w0.254: C34.1 55.49,35.18 55.49,37.12 55.49,37.13 X3.1 54.48,36.25 U1.5
OSC_OUT: length 6.9
  Top Layer w0.254: U1.6 52.37,36.75 52.63,37.01 52.63,38.79 53.3,39.45 X3.3 53.74,41.69 C33.2
PA3_BL: length 31.3
  Top Layer w0.254: GND 3V3 SCL SDA.8 49.75,63.86 U1.13
PA6_DC: length 29.8
  Top Layer w0.254: U1.16 48.25,67.44 GND 3V3 SCL SDA.6
PA13/SWDIO: length 41.6
  Top Layer w0.254: U1.34 42.05,35.25 41.02,34.22 41.02,31.56 66.74,5.84 H1.4
PA14/SWCLK: length 37.7
  Top Layer w0.254: H1.6 69.34,5.84 44.25,30.93 U1.37
PB12_01: length 34
  Top Layer w0.254: U1.25 37.21,39.75 30.7,46.26 PB12.1
PB13_02: length 36.7
  Top Layer w0.254: U1.26 37.08,39.25 25.7,50.63 PB13.1
PB14_03: length 39.3
  Top Layer w0.254: PB14.1 20.7,54.99 36.94,38.75 U1.27
PB15_04: length 42
  Top Layer w0.254: U1.28 36.81,38.25 15.7,59.36 PB15.1
SPI_CS_NSS: length 30.4
  Top Layer w0.254: GND 3V3 SCL SDA.7 49.25,65.9 U1.14
SPI_SCL_SCK: length 50.9
  Top Layer w0.254: 48.82,40.71 48.82,40.72 ; 48.82,40.71 48.82,40.72 ; 48.82,40.71 48.82,40.71 ; 48.82,40.71 48.81,40.71 48.81,40.73 48.82,40.72 ; 48.82,40.72 48.82,40.72 ; 48.82,40.71 48.84,40.7 48.84,40.64 arc(48.87,40.48) 48.96,40.34 arc(48.98,40.32) 49.01,40.3 arc(49.04,40.28) 49.09,40.25 arc(49.09,40.25) 49.1,40.25 arc(49.11,40.24) 49.12,40.22 49.63,40.22 arc(49.67,40.22) 49.7,40.22 arc(49.73,40.22) 49.75,40.22 arc(49.86,40.24) 49.97,40.28 arc(50.14,40.37) 50.29,40.49 51.94,42.15 51.94,58.67 57.91,64.64 57.91,69.57 55.99,71.5 44.69,71.5 GND 3V3 SCL SDA.3 ; 48.82,40.71 48.82,40.72 ; 48.82,40.72 48.83,40.73 48.84,40.73 arc(48.77,40.99) U1.15
SPI_SDA_MOSI: length 29.6
  Top Layer w0.254: GND 3V3 SCL SDA.4 47.75,67.98 U1.17
USART1_RX: length 48.1
  Top Layer w0.254: H1.7 71.13,4.43 69.1,4.43 68.31,5.22 68.31,6.31 43.84,30.79 43.84,33.54 44.7,34.4 44.7,35.73 43.69,36.75 U1.31
USART1_TX: length 48.4
  Top Layer w0.254: H1.5 68.59,4.43 66.69,4.43 65.77,5.35 65.77,6.31 40.66,31.42 40.66,35.87 42.05,37.25 U1.30
USART3_RX: length 51.8
  Top Layer w0.254: H2.3 78.74,4.96 45.25,38.45 U1.22
USART3_TX: length 52.8
  Top Layer w0.254: H2.2 81,3.3 45.84,38.46 45.84,41.16 U1.21
$1N1992: length 2.6
  Top Layer w1: R12.1 61.16,2.88 LED1.2
$1N3257: length 65.2
  Top Layer w0.254: R38.1 46.23,62.74 42.06,66.91 42.06,70.47 43.45,71.86 56.13,71.86 59.92,68.07 67.82,68.07 BOOT1.1 BOOT1#2.2
$1N4256: length 5.1
  Top Layer w1: U14.1 28.57,13.19 C7.1
$1N4260: length 3.9
  Top Layer w1: R6.1 24.65,17.15 R7.2 22.73,17.14 U14.4
$1N4269: length 2.1
  Top Layer w1: LED4.2 27,4.74 26.89,4.85
$1N14427: length 11.3
  Top Layer w0.254: 1.55,34.04 5.78,34.04 7.62,32.19 7.62,28.65 7.33,28.36 USB1.A5
$1N14460: length 7.3
  Top Layer w0.254: 1.78,21.71 3.17,23.1 3.17,25.53 4.76,27.11 USB1.B5
$1N14892: length 3.5
  Top Layer w0.8: R41.2 10.95,35.66 R42.1 9.34,35.64 U31.3
$1N19318: length 25.3
  Top Layer w1: Q1.3 19.63,42.03 LED7.1 LED5.1 6.61,46.09 R43.2
$1N19371: length 2.2
  Top Layer w0.7: Q1.1 24.45,31.68 R44.2
$1N21612: length 72.2
  Top Layer w0.254: 41.66,44.71 41.66,46.74 39.52,48.87 39.52,70.47 41.27,72.21 56.28,72.21 60.07,68.43 67.97,68.43 70.86,65.54 76.85,65.54 77.73,64.66 BOOT0.1
$1N31426: length 2.2
  Top Layer w1: LED8.2 29.18,2.93 R45.1

## Copper pours and planes (outline as drawn; the poured copper is in the pictures)
3V3 on Top Layer: 41.16,20.47 47.5,20.47 47.5,17.65 41.16,17.65
3V3 on Top Layer: 57.28,6.22 59.99,6.22 59.99,4.75 57.28,4.75
3V3 on Top Layer: 47.5,7.87 49.53,7.87 49.53,6.1 47.5,6.1
3V3 on Top Layer: 45.72,7.24 58.42,7.24 58.42,4.57 45.72,4.57
3V3 on Top Layer: 42.05,34.48 43.43,34.48 43.43,32.39 42.05,32.39
3V3 on Top Layer: 45.34,20.47 48.39,20.47 48.39,4.32 45.34,4.32
+5V on Top Layer: 40.26,17.5 45.21,17.5 45.21,3.68 40.26,3.68
+5V on Top Layer: 39.12,7.87 40.89,7.87 40.89,6.1 39.12,6.1
+5V on Top Layer: 24,20.11 39.75,20.11 39.75,18.03 24,18.03
+5V on Top Layer: 29.46,18.42 40.75,18.42 40.75,14.39 29.46,14.39
+5V on Top Layer: 30.23,7.24 45.34,7.24 45.34,4.19 30.23,4.19
+5V on Top Layer: 37.82,20.78 39.73,20.78 39.73,19.62 37.82,19.62
GND on Top Layer: 0,74 93.98,74 93.98,-0.04 0,-0.04
GND on Bottom Layer: 0,74 93.98,74 93.98,-0.04 0,-0.04
VCC on Top Layer: 4.83,26.92 13.43,26.92 13.43,25.73 4.83,25.73
VCC on Top Layer: 8.2,32.03 15.65,32.03 15.65,25.61 8.2,25.61
VIN on Top Layer: 8.65,22.56 13.05,22.56 13.05,1.15 8.65,1.15
VIN on Top Layer: 23.69,30.86 27.31,30.86 27.31,28.07 23.69,28.07
VIN on Top Layer: 3.17,22.48 8.98,22.48 8.98,8.6 3.17,8.6
VIN on Bottom Layer: 3.05,22.48 9.02,22.48 9.02,14.73 3.05,14.73
$1N4251 on Top Layer: 13.22,11.27 21.59,11.27 21.59,1.14 13.22,1.14
$1N4251 on Top Layer: 13.24,10.92 25.86,10.92 25.86,1.15 13.24,1.15
$1N4254 on Top Layer: 25.86,10.97 40,10.97 40,8.38 25.86,8.38
$1N6190 on Bottom Layer: 84.84,41.15 91.44,41.15 91.44,14.22 84.84,14.22
$1N6207 on Bottom Layer: 2.79,59.56 9.02,59.56 9.02,33.02 2.79,33.02
$1N14741 on Top Layer: 10.92,36.27 19.18,36.27 19.18,31.5 10.92,31.5

## Text on the board
Top Silkscreen Layer: GND RX3 TX3 5V | GND | 5V | 3V3 | 3V3 DIO  CLK GND / 5V GND TX1 RX1
